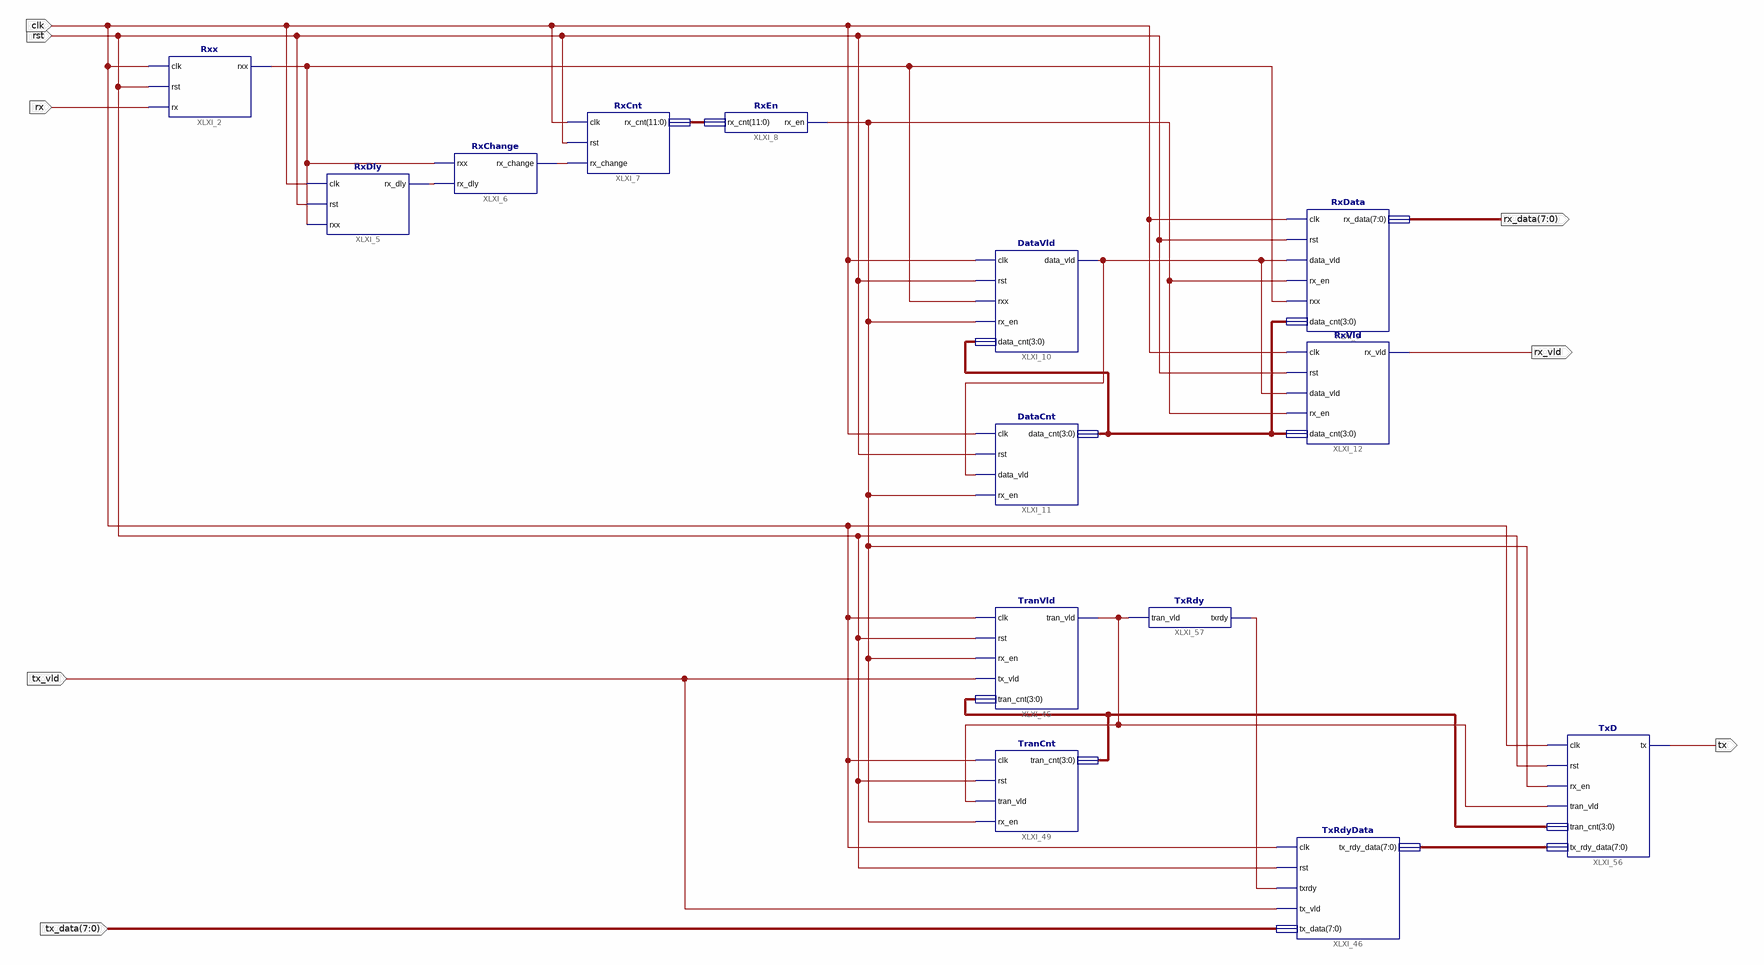
[diagram p0: schematic sheet 1]
// Xilinx ISE schematic rxtxSch.sch (spartan6) as structural Verilog: 14 symbols, 8 ports
module rxtxSch (
  input  rx,
  input  rst,
  input  clk,
  input  [7:0] tx_data,
  input  tx_vld,
  output [7:0] rx_data,
  output rx_vld,
  output tx
);

  wire XLXN_9, XLXN_10, XLXN_26, XLXN_268, XLXN_298, XLXN_323, XLXN_516;
  wire [3:0] XLXN_275, XLXN_471;
  wire [7:0] XLXN_510;
  wire [11:0] XLXN_22;

  RxDly XLXI_5 (.clk(clk), .rst(rst), .rxx(XLXN_26), .rx_dly(XLXN_10));
  RxChange XLXI_6 (.rxx(XLXN_26), .rx_dly(XLXN_10), .rx_change(XLXN_9));
  DataVld XLXI_10 (.clk(clk), .rst(rst), .rxx(XLXN_26), .rx_en(XLXN_516), .data_cnt(XLXN_275), .data_vld(XLXN_268));
  RxCnt XLXI_7 (.clk(clk), .rst(rst), .rx_change(XLXN_9), .rx_cnt(XLXN_22));
  RxEn XLXI_8 (.rx_cnt(XLXN_22), .rx_en(XLXN_516));
  RxData XLXI_9 (
    .clk(clk), .rst(rst), .data_vld(XLXN_268), .rx_en(XLXN_516), .rxx(XLXN_26), .data_cnt(XLXN_275),
    .rx_data(rx_data));
  Rxx XLXI_2 (.clk(clk), .rst(rst), .rx(rx), .rxx(XLXN_26));
  RxVld XLXI_12 (.clk(clk), .rst(rst), .data_vld(XLXN_268), .rx_en(XLXN_516), .data_cnt(XLXN_275), .rx_vld(rx_vld));
  DataCnt XLXI_11 (.clk(clk), .rst(rst), .data_vld(XLXN_268), .rx_en(XLXN_516), .data_cnt(XLXN_275));
  TxD XLXI_56 (
    .clk(clk), .rst(rst), .rx_en(XLXN_516), .tran_vld(XLXN_298), .tran_cnt(XLXN_471), .tx_rdy_data(XLXN_510),
    .tx(tx));
  TxRdy XLXI_57 (.tran_vld(XLXN_298), .txrdy(XLXN_323));
  TxRdyData XLXI_46 (
    .clk(clk), .rst(rst), .txrdy(XLXN_323), .tx_vld(tx_vld), .tx_data(tx_data), .tx_rdy_data(XLXN_510));
  TranVld XLXI_45 (.clk(clk), .rst(rst), .rx_en(XLXN_516), .tx_vld(tx_vld), .tran_cnt(XLXN_471), .tran_vld(XLXN_298));
  TranCnt XLXI_49 (.clk(clk), .rst(rst), .tran_vld(XLXN_298), .rx_en(XLXN_516), .tran_cnt(XLXN_471));
endmodule
